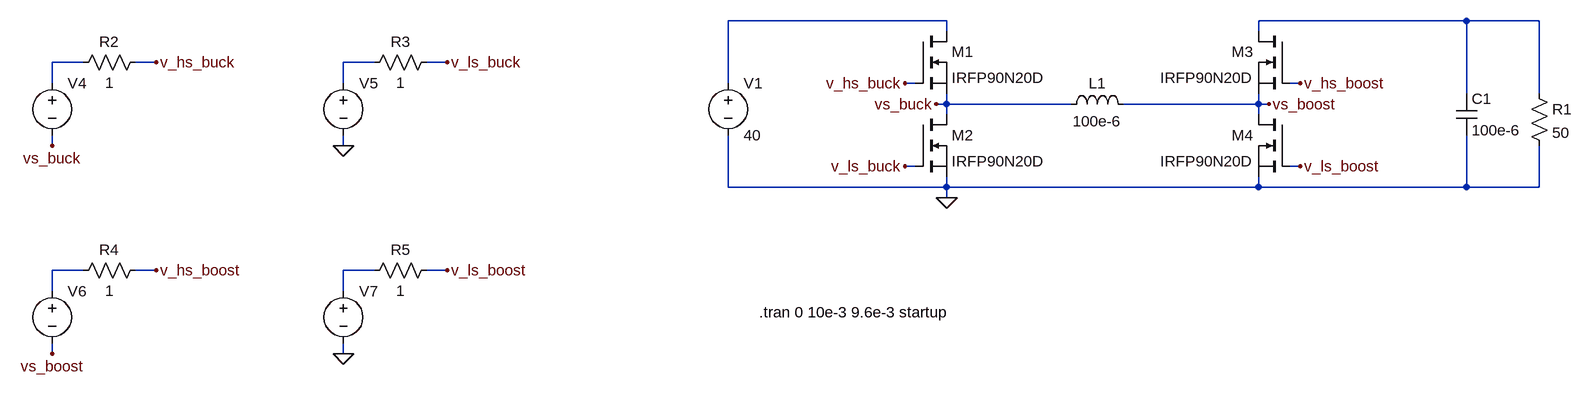
[diagram p0: schematic buck-boost.asc]
buck-boost.asc, the LTspice schematic file:
Version 4
SHEET 1 1656 724
WIRE 272 -368 -64 -368
WIRE 1072 -368 752 -368
WIRE 1184 -368 1072 -368
WIRE 272 -352 272 -368
WIRE 752 -352 752 -368
WIRE -1056 -304 -1104 -304
WIRE -944 -304 -976 -304
WIRE -608 -304 -656 -304
WIRE -496 -304 -528 -304
WIRE -1104 -272 -1104 -304
WIRE -656 -272 -656 -304
WIRE -64 -272 -64 -368
WIRE 224 -272 208 -272
WIRE 816 -272 800 -272
WIRE 1072 -256 1072 -368
WIRE 1184 -256 1184 -368
WIRE 272 -240 272 -256
WIRE 272 -240 256 -240
WIRE 464 -240 272 -240
WIRE 752 -240 752 -256
WIRE 752 -240 544 -240
WIRE 768 -240 752 -240
WIRE 272 -224 272 -240
WIRE 752 -224 752 -240
WIRE -1104 -176 -1104 -192
WIRE -656 -176 -656 -192
WIRE 224 -144 208 -144
WIRE 816 -144 800 -144
WIRE -64 -112 -64 -192
WIRE 272 -112 272 -128
WIRE 272 -112 -64 -112
WIRE 752 -112 752 -128
WIRE 752 -112 272 -112
WIRE 1072 -112 1072 -192
WIRE 1072 -112 752 -112
WIRE 1184 -112 1184 -176
WIRE 1184 -112 1072 -112
WIRE 272 -96 272 -112
WIRE -1056 16 -1104 16
WIRE -944 16 -976 16
WIRE -608 16 -656 16
WIRE -496 16 -528 16
WIRE -1104 48 -1104 16
WIRE -656 48 -656 16
WIRE -1104 144 -1104 128
WIRE -656 144 -656 128
FLAG 256 -240 vs_buck
FLAG -944 -304 v_hs_buck
FLAG -1104 -176 vs_buck
FLAG 208 -272 v_hs_buck
FLAG 272 -96 0
FLAG -656 -176 0
FLAG -496 -304 v_ls_buck
FLAG 208 -144 v_ls_buck
FLAG -944 16 v_hs_boost
FLAG -1104 144 vs_boost
FLAG -656 144 0
FLAG -496 16 v_ls_boost
FLAG 768 -240 vs_boost
FLAG 816 -272 v_hs_boost
FLAG 816 -144 v_ls_boost
SYMBOL ind 448 -224 R270
WINDOW 0 32 56 VTop 2
WINDOW 3 5 56 VBottom 2
SYMATTR InstName L1
SYMATTR Value 100e-6
SYMATTR SpiceLine Rser=15e-3
SYMBOL cap 1056 -256 R0
SYMATTR InstName C1
SYMATTR Value 100e-6
SYMATTR SpiceLine Rser=60e-3
SYMBOL res 1168 -272 R0
SYMATTR InstName R1
SYMATTR Value 50
SYMBOL voltage -64 -288 R0
WINDOW 123 0 0 Left 0
WINDOW 39 0 0 Left 0
SYMATTR InstName V1
SYMATTR Value 40
SYMBOL res -960 -320 R90
WINDOW 0 0 56 VBottom 2
WINDOW 3 32 56 VTop 2
SYMATTR InstName R2
SYMATTR Value 1
SYMBOL res -512 -320 R90
WINDOW 0 0 56 VBottom 2
WINDOW 3 32 56 VTop 2
SYMATTR InstName R3
SYMATTR Value 1
SYMBOL nmos 224 -224 R0
SYMATTR InstName M2
SYMATTR Value IRFP90N20D
SYMBOL nmos 224 -352 R0
SYMATTR InstName M1
SYMATTR Value IRFP90N20D
SYMBOL nmos 800 -352 M0
SYMATTR InstName M3
SYMATTR Value IRFP90N20D
SYMBOL nmos 800 -224 M0
SYMATTR InstName M4
SYMATTR Value IRFP90N20D
SYMBOL res -960 0 R90
WINDOW 0 0 56 VBottom 2
WINDOW 3 32 56 VTop 2
SYMATTR InstName R4
SYMATTR Value 1
SYMBOL res -512 0 R90
WINDOW 0 0 56 VBottom 2
WINDOW 3 32 56 VTop 2
SYMATTR InstName R5
SYMATTR Value 1
SYMBOL voltage -1104 -288 R0
WINDOW 3 24 96 Invisible 2
WINDOW 123 0 0 Left 0
WINDOW 39 0 0 Left 0
SYMATTR Value PULSE(0 12 5e-6 10e-9 10e-9 5e-6 10e-6)
SYMATTR InstName V4
SYMBOL voltage -656 -288 R0
WINDOW 3 24 96 Invisible 2
WINDOW 123 0 0 Left 0
WINDOW 39 0 0 Left 0
SYMATTR Value PULSE(0 12 0.2e-6 10e-9 10e-9 4.6e-6 10e-6)
SYMATTR InstName V5
SYMBOL voltage -1104 32 R0
WINDOW 3 24 96 Invisible 2
WINDOW 123 0 0 Left 0
WINDOW 39 0 0 Left 0
SYMATTR Value 12
SYMATTR InstName V6
SYMBOL voltage -656 32 R0
WINDOW 3 24 96 Invisible 2
WINDOW 123 0 0 Left 0
WINDOW 39 0 0 Left 0
SYMATTR Value 0
SYMATTR InstName V7
TEXT -16 80 Left 2 !.tran 0 10e-3 9.6e-3 startup

The netlist it stands for:
* buck-boost.asc
L1 vs_buck vs_boost 100e-6 Rser=15e-3
C1 N002 0 100e-6 Rser=60e-3
R1 N002 0 50
V1 N001 0 40
R2 v_hs_buck N003 1
R3 v_ls_buck N004 1
M2 vs_buck v_ls_buck 0 0 IRFP90N20D
M1 N001 v_hs_buck vs_buck vs_buck IRFP90N20D
M3 N002 v_hs_boost vs_boost vs_boost IRFP90N20D
M4 vs_boost v_ls_boost 0 0 IRFP90N20D
R4 v_hs_boost N005 1
R5 v_ls_boost N006 1
V4 N003 vs_buck PULSE(0 12 5e-6 10e-9 10e-9 5e-6 10e-6)
V5 N004 0 PULSE(0 12 0.2e-6 10e-9 10e-9 4.6e-6 10e-6)
V6 N005 vs_boost 12
V7 N006 0 0
.model NMOS NMOS
.model PMOS PMOS
.lib standard.mos
.tran 0 10e-3 9.6e-3 startup
.backanno
.end